# Altium project MABSS_sensorboard_ATtinyx41.PrjPcb
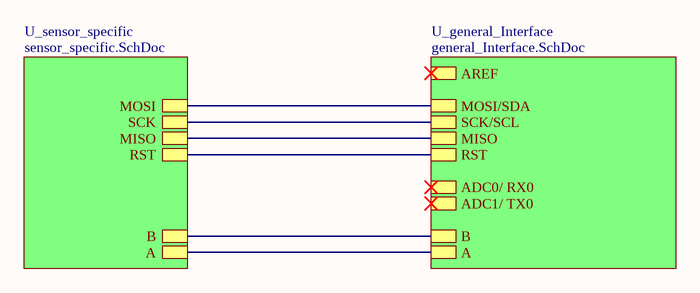
[diagram p0: master_sheet.SchDoc]
3 sheets, 13 parts. Net scope: hierarchical (ports join the sheet entries above them; power ports are global).
Sheets:
  master_sheet.SchDoc
    U_sensor_specific = sensor_specific.SchDoc
    U_general_Interface = general_Interface.SchDoc

## Sheet master_sheet.SchDoc
size A4

### Sub-sheets
U_general_Interface = general_Interface.SchDoc: AREF, MOSI/SDA, SCK/SCL, MISO, RST, ADC0/ RX0, ADC1/ TX0, B, A
U_sensor_specific = sensor_specific.SchDoc: MOSI, SCK, MISO, RST, B, A

### Nets
NetP1_1: sheet U_sensor_specific/RST, sheet U_general_Interface/RST
NetP1_2: sheet U_sensor_specific/MISO, sheet U_general_Interface/MISO
NetP1_3: sheet U_sensor_specific/SCK, sheet U_general_Interface/SCK/SCL
NetP1_4: sheet U_sensor_specific/MOSI, sheet U_general_Interface/MOSI/SDA
NetP2_2: sheet U_sensor_specific/A, sheet U_general_Interface/A
NetP2_3: sheet U_sensor_specific/B, sheet U_general_Interface/B

## Sheet sensor_specific.SchDoc
size A4
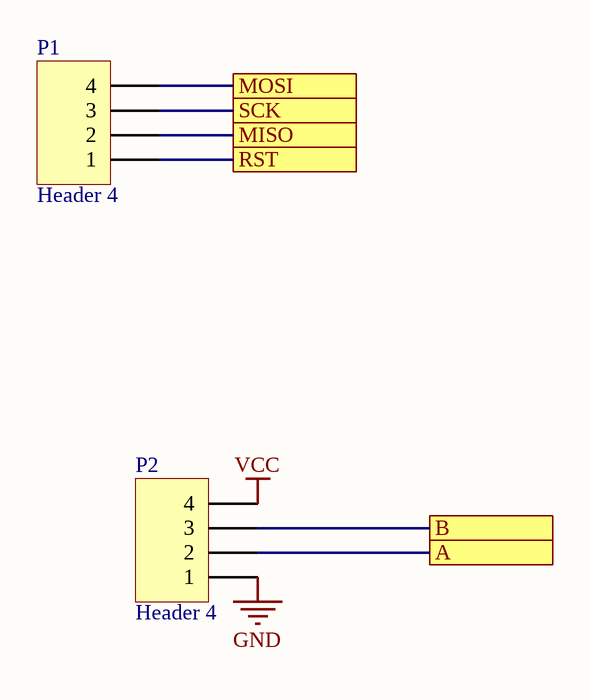
[diagram p1: sensor_specific.SchDoc]

### Parts
P1  Header 4  [HDR1X4]
P2  Header 4  [HDR1X4]

### Ports
A, B, MISO, MOSI, RST, SCK

### Nets
GND: P2.1
VCC: P2.4
NetP1_1: P1.1 ; port RST
NetP1_2: P1.2 ; port MISO
NetP1_3: P1.3 ; port SCK
NetP1_4: P1.4 ; port MOSI
NetP2_2: P2.2 ; port A
NetP2_3: P2.3 ; port B

### Library data of the parts
P1 P2 = Header 4: Header, 4-Pin; LatestRevisionDate: 17-Jul-2002; LatestRevisionNote: Re-released for DXP Platform.; Publisher: Altium Limited

## Sheet general_Interface.SchDoc
size A4
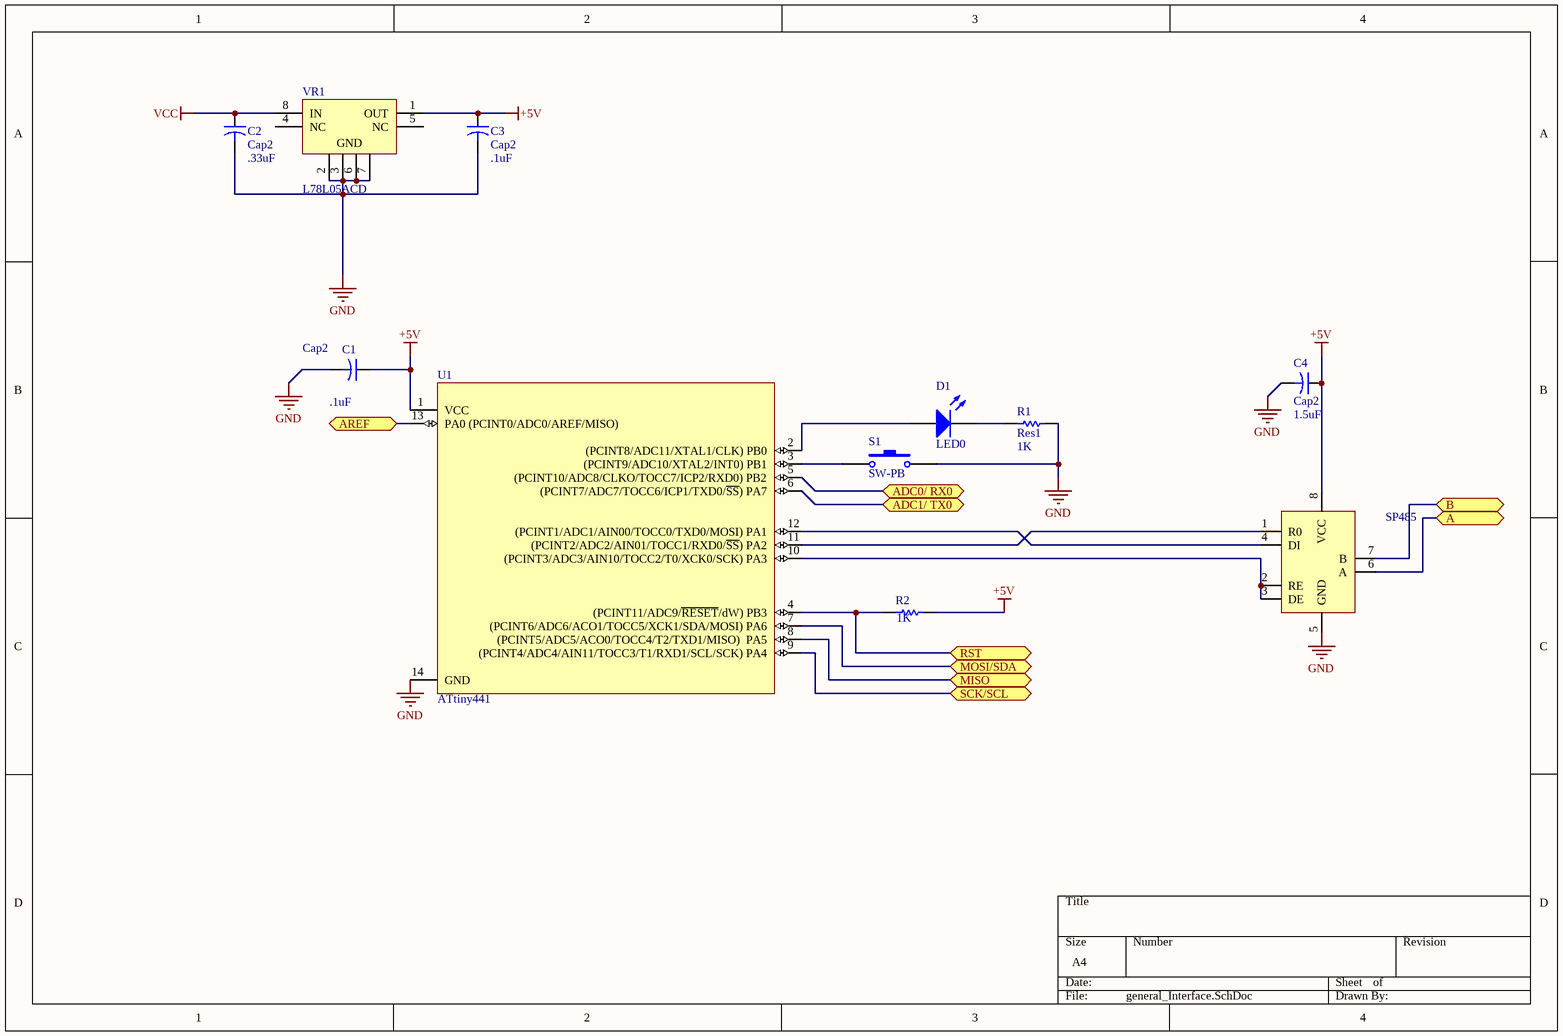
[diagram p2: general_Interface.SchDoc]

### Parts
C1  Cap2  value .1uF  [6-0805_N]
C2  Cap2  value .33uF  [6-0805_N]
C3  Cap2  value .1uF  [6-0805_N]
C4  Cap2  value 1.5uF  [6-0805_N]
D1  LED0  [1608[0603]]
R1  Res1  value 1K  [6-0805_N]
R2  value 1K  [6-0805_N]  (hidden comment: Res1)
S1  SW-PB  [ADTSM3]
SP485  SP485  [8S1_M]  (value not drawn)
U1  ATtiny441  [6ST1_L]
VR1  L78L05ACD  [SO8_N]

### Ports
A, ADC0/ RX0, ADC1/ TX0, AREF, B, MISO, MOSI/SDA, RST, SCK/SCL

### Nets
+5V: C1.1 C3.1 C4.1 R2.2 SP485.8(VCC) U1.1(VCC) VR1.1(OUT)
GND: C1.2 C2.2 C3.2 C4.2 R1.2 S1.2 SP485.5(GND) U1.14(GND) VR1.2(GND) VR1.3(GND) VR1.6(GND) VR1.7(GND)
VCC: C2.1 VR1.8(IN)
NetD1_1: D1.1(A) U1.2((PCINT8/ADC11/XTAL1/CLK)_PB0)
NetD1_2: D1.2(K) R1.1
NetP1_1: R2.1 U1.4((PCINT11/ADC9/~{RESET}/dW)_PB3) ; port RST
NetP1_2: U1.8((PCINT5/ADC5/ACO0/TOCC4/T2/TXD1/MISO)__PA5) ; port MISO
NetP1_3: U1.9((PCINT4/ADC4/AIN11/TOCC3/T1/RXD1/SCL/SCK)_PA4) ; port SCK/SCL
NetP1_4: U1.7((PCINT6/ADC6/ACO1/TOCC5/XCK1/SDA/MOSI)_PA6) ; port MOSI/SDA
NetP2_2: SP485.6(A) ; port A
NetP2_3: SP485.7(B) ; port B
NetS1_1: S1.1 U1.3((PCINT9/ADC10/XTAL2/INT0)_PB1)
NetSP485_1: SP485.1(R0) U1.11((PCINT2/ADC2/AIN01/TOCC1/RXD0/~{SS})_PA2)
NetSP485_2: SP485.2(RE) SP485.3(DE) U1.10((PCINT3/ADC3/AIN10/TOCC2/T0/XCK0/SCK)_PA3)
NetSP485_4: SP485.4(DI) U1.12((PCINT1/ADC1/AIN00/TOCC0/TXD0/MOSI)_PA1)
NetU1_5: U1.5((PCINT10/ADC8/CLKO/TOCC7/ICP2/RXD0)_PB2) ; port ADC0/ RX0
NetU1_6: U1.6((PCINT7/ADC7/TOCC6/ICP1/TXD0/~{SS})_PA7) ; port ADC1/ TX0
NetU1_13: U1.13(PA0_(PCINT0/ADC0/AREF/MISO)) ; port AREF

Not connected (* = marked no-connect by the designer): VR1 4(NC) 5(NC)

### Library data of the parts
C1-C4 = Cap2: Capacitor; Published: 23-Sep-2002; PackageReference: CAPR5-4X5; Publisher: Altium Limited; PackageDescription: Capacitor; 2 Leads
D1 = LED0: Typical INFRARED GaAs LED; Published: 8-Jun-2000; LatestRevisionDate: 08-Jul-2005; LatestRevisionNote: Mech Layer 1 removed.; PackageReference: LED-0; Publisher: Altium Limited; PackageDescription: LED; 2 Leads
R1 R2 = Res1: Resistor; Published: 8-Jun-2000; LatestRevisionDate: 17-Jul-2002; LatestRevisionNote: Re-released for DXP Platform.; PackageReference: AXIAL-0.3; Publisher: Altium Limited; PackageDescription: Axial Device, Thru-Hole; 2 Leads; 0.3 in Pin Spacing
S1 = SW-PB: Switch; Published: 24-Mar-1999; LatestRevisionDate: 17-Jul-2002; LatestRevisionNote: Re-released for DXP Platform.; PackageReference: SPST-2; Publisher: Altium Limited; PackageDescription: Switch; 2 Leads
VR1 = L78L05ACD: Positive Voltage Regulator; Published: 24-Aug-2001; LatestRevisionDate: 13-Apr-2006; LatestRevisionNote: IPC-7351 Footprint Added.; DatasheetVersion: Feb-1999; PackageVersion: Dec-2002; PackageReference: SO8; Publisher: Altium Limited; PackageDescription: 8-Pin Small Outline Integrated Circuit 1.27 mm Pitch; Code_JEDEC: MS-012-AA; Code_IPC: SOIC127P600-8; ComponentLink1Description: Manufacturer Link; ComponentLink1URL: http://www.st.com/

## Nets that join several sheets
GND: sensor_specific (P2.1), general_Interface (12 pins)
VCC: sensor_specific (P2.4), general_Interface (C2.1 VR1.8)
NetP1_1: sensor_specific (P1.1), general_Interface (R2.1 U1.4)
NetP1_2: sensor_specific (P1.2), general_Interface (U1.8)
NetP1_3: sensor_specific (P1.3), general_Interface (U1.9)
NetP1_4: sensor_specific (P1.4), general_Interface (U1.7)
NetP2_2: sensor_specific (P2.2), general_Interface (SP485.6)
NetP2_3: sensor_specific (P2.3), general_Interface (SP485.7)